# Altium schematic sheet ECL_Fanout_X2.SchDoc
size A4; ApprovedBy: Mateusz Kowalik; CheckedBy: Mateusz Kowalik; Author: Mateusz Kowalik; CompanyName: InMotion Labs sp. z o.o.; DrawnBy: Mateusz Kowalik; Engineer: Mateusz Kowalik; Organization: InMotion Labs sp. z o.o.; Address1: Rydlówka 5A; Address2: 30-363 Kraków; Address4: Poland; DocumentNumber: 16; Revision: Rev 0; SheetNumber: 16; SheetTotal: 17
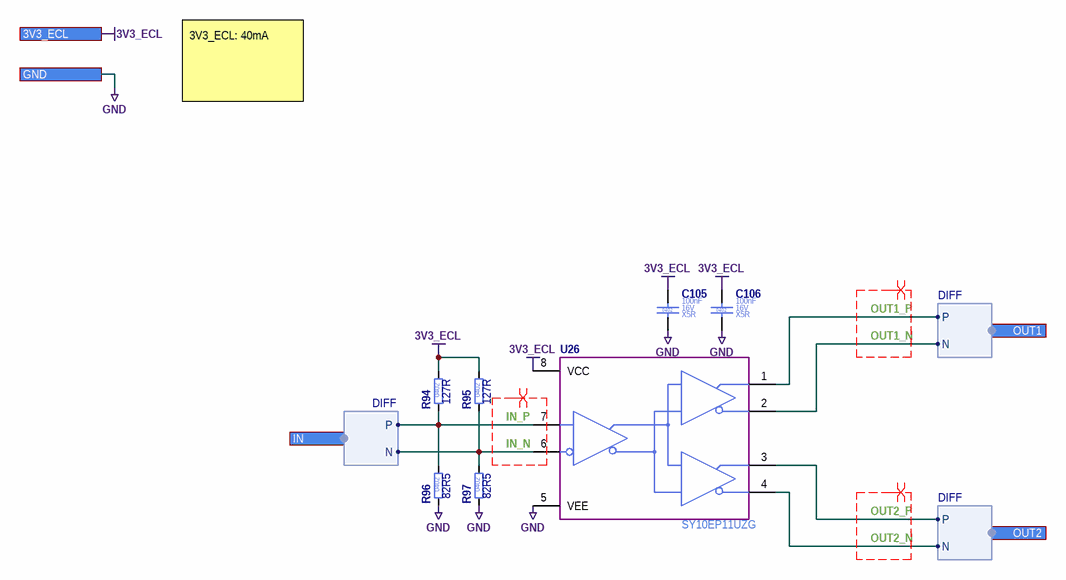
[diagram p0: ECL_Fanout_X2.SchDoc]

## Parts
C105  Case/Package: 0402  Voltage Rating (DC): 16V  Dielectric: X5R  Capacitance: 100nF  [C_0402_1005]  (hidden comment: C_100NF_16V_X5R_0402_10)
C106  Case/Package: 0402  Voltage Rating (DC): 16V  Dielectric: X5R  Capacitance: 100nF  [C_0402_1005]  (hidden comment: C_100NF_16V_X5R_0402_10)
R94  Resistance: 127R  Case/Package: 0402  [R_0402_1005]  (hidden comment: R_127R_0402_1)
R95  Resistance: 127R  Case/Package: 0402  [R_0402_1005]  (hidden comment: R_127R_0402_1)
R96  Resistance: 82R5  Case/Package: 0402  [R_0402_1005]  (hidden comment: R_82R5_0402_1)
R97  Resistance: 82R5  Case/Package: 0402  [R_0402_1005]  (hidden comment: R_82R5_0402_1)
U26  SY10EP11UZG  [SOIC127P600X170-8N]

## Ports
3V3_ECL, GND, IN (harness DIFF), OUT1 (harness DIFF), OUT2 (harness DIFF)

## Harnesses
DIFF: P, N

## Nets
3V3_ECL: C105.1 C106.1 R94.2 R95.2 U26.8(VCC) ; port 3V3_ECL
GND: C105.2 C106.2 R96.1 R97.1 U26.5(VEE) ; port GND
IN_N: R95.1 R97.2 U26.6(~{D}) ; port IN.N
IN_P: R94.1 R96.2 U26.7(D) ; port IN.P
OUT1_N: U26.2(/Q0) ; port OUT1.N
OUT1_P: U26.1(Q0) ; port OUT1.P
OUT2_N: U26.4(~{Q1}) ; port OUT2.N
OUT2_P: U26.3(Q1) ; port OUT2.P

## Layout directives
differential pair; differential pair class D100; net class D100: IN_N, IN_P, OUT1_N, OUT1_P, OUT2_N, OUT2_P

## Notes on the sheet
- 3V3_ECL: 40mA
- Title
- Size:
- Date:
- A4

## Library data of the parts
C105 C106 = C_100NF_16V_X5R_0402_10: Ceramic Capacitor; Manufacturer Part Number: EMK105BJ104KV-F; Manufacturer: Taiyo Yuden; Value: 100nF; Tolerance: 10%; Part Number: C_100NF_16V_X5R_0402_10; Mount: Surface Mount; Height: 500um; HelpURL: http://datasheet.octopart.com/EMK105BJ104KV-F-Taiyo-Yuden-datasheet-8857305.pdf; RoHS: Compliant; Max Operating Temperature: 125°C; Status: MK; Supplier 1: Mouser; Supplier Part Number 1: 963-EMK105BJ104KV-F; Manufacturer 2: Samsung Electro-Mechanics; Manufacturer Part Number 2: CL05B104KO5NNNC; Supplier 2: LCSC; Supplier Part Number 2: C1525
R94 R95 = R_127R_0402_1: Thick Film Resistor; Manufacturer: Yageo; Manufacturer Part Number: RC0402FR-07127RL; Value: 127R; Tolerance: 1%; Voltage Rating (DC): 50V; Power Rating: 63mW; Stats: MK; Part Number: R_127R_0402_1; Mount: Surface Mount; Height: 350um; HelpURL: https://pl.mouser.com/datasheet/2/447/PYu_RC_Group_51_RoHS_L_10-1664068.pdf; RoHS: Compliant; Max Operating Temperature: 155°C; Supplier 1: Mouser; Supplier Part Number 1: 603-RC0402FR-07127RL; Manufacturer 2: Uniroyal Elec; Manufacturer Part Number 2: 0402WGF1270TCE; Supplier 2: LCSC; Supplier Part Number 2: C247127
R96 R97 = R_82R5_0402_1: Thick Film Resistor; Manufacturer: Yageo; Manufacturer Part Number: RC0402FR-0782R5L; Value: 82R5; Tolerance: 1%; Voltage Rating (DC): 50V; Power Rating: 63mW; Stats: MK; Part Number: R_82R5_0402_1; Mount: Surface Mount; Height: 350um; HelpURL: https://pl.mouser.com/datasheet/2/447/PYu-RC_Group_51_RoHS_L_10-1527934.pdf; RoHS: Compliant; Max Operating Temperature: 155°C; Supplier 1: Mouser; Supplier Part Number 1: 603-RC0402FR-0782R5L; Manufacturer 2: Uniroyal Elec; Manufacturer Part Number 2: 0402WGF825JTCE; Supplier 2: LCSC; Supplier Part Number 2: C52037
U26 = SY10EP11UZG: 1:2 PECL Fanout Buffer; Manufacturer: Microchip; Max Output Current: 100mA; Marking: Z8-1; Max Supply Voltage: 3.6V; Min Supply Voltage: 3.0V; Part Number: SY10EP11UZG; Case/Package: SOIC8; Mount: Surface Mount; Height: 1.75mm; HelpURL: https://datasheet.octopart.com/SY10EP11UZG-Microchip-datasheet-39498.pdf; Max Operating Temperature: 85°C; RoHS: Compliant; Status: MK; Manufacturer Part Number: SY10EP11UZG; Supplier 1: Mouser; Supplier Part Number 1: 998-SY10EP11UZG